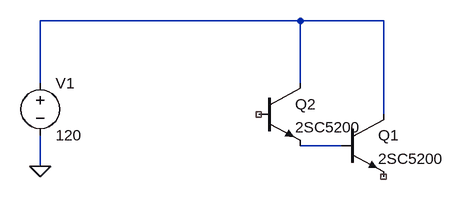
[diagram p0: schematic Draft1.asc]
Draft1.asc, the LTspice schematic file:
Version 4
SHEET 1 880 680
WIRE 160 -32 -240 -32
WIRE 288 -32 160 -32
WIRE -240 64 -240 -32
WIRE 160 64 160 -32
WIRE 288 112 288 -32
WIRE 224 160 160 160
WIRE -240 192 -240 144
FLAG -240 192 0
SYMBOL npn 224 112 R0
SYMATTR InstName Q1
SYMATTR Value 2SC5200
SYMBOL npn 96 64 R0
SYMATTR InstName Q2
SYMATTR Value 2SC5200
SYMBOL voltage -240 48 R0
WINDOW 123 0 0 Left 0
WINDOW 39 0 0 Left 0
SYMATTR InstName V1
SYMATTR Value 120

The netlist it stands for:
* Draft1.asc
Q1 N001 N002 NC_01 0 2SC5200
Q2 N001 NC_02 N002 0 2SC5200
V1 N001 0 120
.model NPN NPN
.model PNP PNP
.lib standard.bjt
.backanno
.end